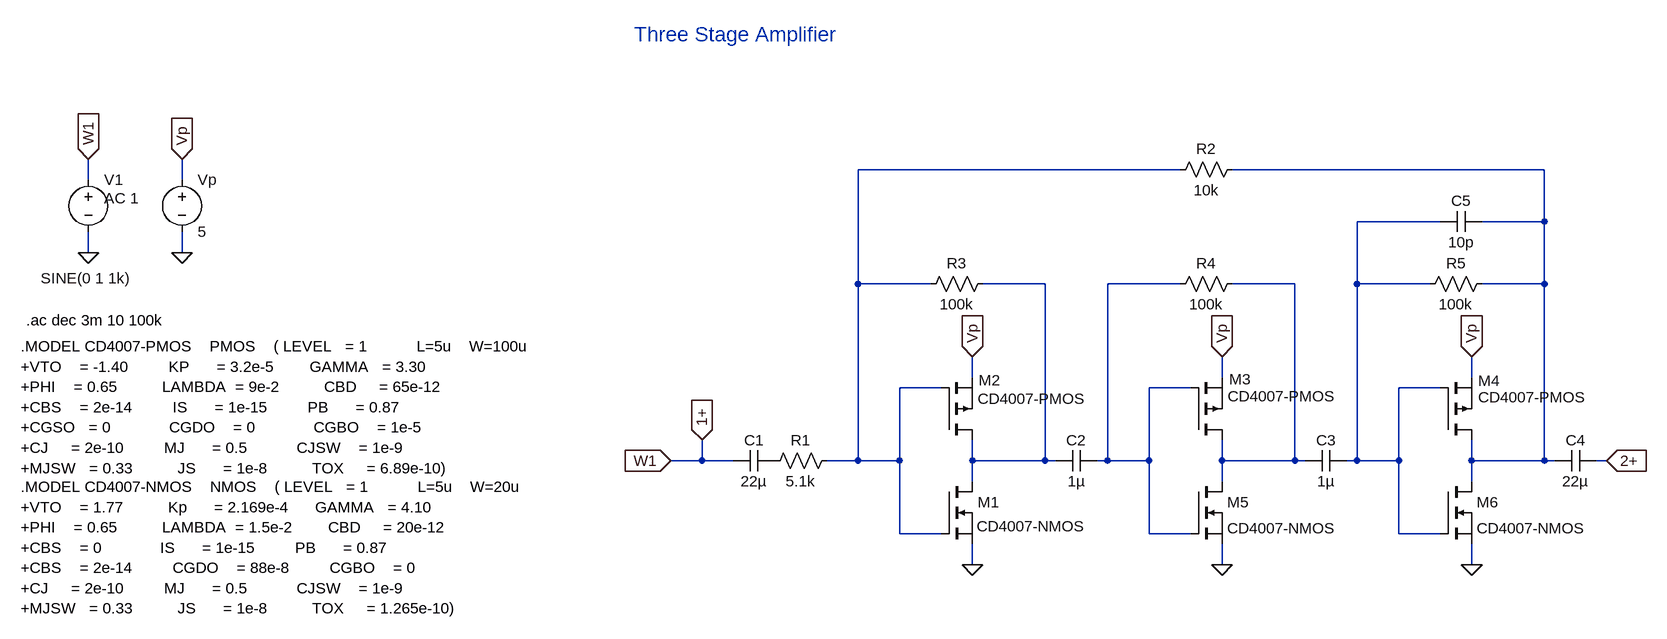
[diagram p0: schematic cmos_amplifier_hardware_setup_3a.asc]
cmos_amplifier_hardware_setup_3a.asc, the LTspice schematic file:
Version 4
SHEET 1 6340 1512
WIRE 912 800 416 800
WIRE 1472 800 992 800
WIRE -768 816 -768 784
WIRE -624 816 -624 784
WIRE 1312 880 1184 880
WIRE 1472 880 1472 800
WIRE 1472 880 1376 880
WIRE -768 928 -768 896
WIRE -624 928 -624 896
WIRE 416 976 416 800
WIRE 528 976 416 976
WIRE 704 976 608 976
WIRE 912 976 800 976
WIRE 1088 976 992 976
WIRE 1184 976 1184 880
WIRE 1296 976 1184 976
WIRE 1472 976 1472 880
WIRE 1472 976 1376 976
WIRE 592 1120 592 1088
WIRE 976 1120 976 1088
WIRE 1360 1120 1360 1088
WIRE 544 1136 480 1136
WIRE 928 1136 864 1136
WIRE 1312 1136 1248 1136
WIRE 176 1248 176 1216
WIRE 176 1248 128 1248
WIRE 224 1248 176 1248
WIRE 416 1248 416 976
WIRE 416 1248 368 1248
WIRE 480 1248 480 1136
WIRE 480 1248 416 1248
WIRE 592 1248 592 1216
WIRE 704 1248 704 976
WIRE 704 1248 592 1248
WIRE 720 1248 704 1248
WIRE 800 1248 800 976
WIRE 800 1248 784 1248
WIRE 864 1248 864 1136
WIRE 864 1248 800 1248
WIRE 976 1248 976 1216
WIRE 1088 1248 1088 976
WIRE 1088 1248 976 1248
WIRE 1104 1248 1088 1248
WIRE 1184 1248 1184 976
WIRE 1184 1248 1168 1248
WIRE 1248 1248 1248 1136
WIRE 1248 1248 1184 1248
WIRE 1360 1248 1360 1216
WIRE 1472 1248 1472 976
WIRE 1472 1248 1360 1248
WIRE 1488 1248 1472 1248
WIRE 1568 1248 1552 1248
WIRE 592 1280 592 1248
WIRE 976 1280 976 1248
WIRE 1360 1280 1360 1248
WIRE 480 1360 480 1248
WIRE 544 1360 480 1360
WIRE 864 1360 864 1248
WIRE 928 1360 864 1360
WIRE 1248 1360 1248 1248
WIRE 1312 1360 1248 1360
WIRE 592 1408 592 1376
WIRE 976 1408 976 1376
WIRE 1360 1408 1360 1376
FLAG 592 1408 0
FLAG 592 1088 Vp
IOPIN 592 1088 In
FLAG 128 1248 W1
IOPIN 128 1248 In
FLAG -768 928 0
FLAG -624 928 0
FLAG -624 784 Vp
IOPIN -624 784 In
FLAG -768 784 W1
IOPIN -768 784 In
FLAG 176 1216 1+
IOPIN 176 1216 In
FLAG 976 1408 0
FLAG 1360 1408 0
FLAG 976 1088 Vp
IOPIN 976 1088 In
FLAG 1360 1088 Vp
IOPIN 1360 1088 In
FLAG 1568 1248 2+
IOPIN 1568 1248 In
SYMBOL nmos 544 1280 R0
WINDOW 3 55 69 Left 2
SYMATTR Value CD4007-NMOS
SYMATTR InstName M1
SYMBOL pmos 544 1216 M180
WINDOW 3 56 63 Left 2
WINDOW 0 58 92 Left 2
SYMATTR Value CD4007-PMOS
SYMATTR InstName M2
SYMBOL voltage -624 800 R0
WINDOW 123 0 0 Left 0
WINDOW 39 0 0 Left 0
SYMATTR InstName Vp
SYMATTR Value 5
SYMBOL res 384 1232 R90
WINDOW 0 0 56 VBottom 2
WINDOW 3 32 56 VTop 2
SYMATTR InstName R1
SYMATTR Value 5.1k
SYMBOL res 624 960 R90
WINDOW 0 0 56 VBottom 2
WINDOW 3 32 56 VTop 2
SYMATTR InstName R3
SYMATTR Value 100k
SYMBOL cap 288 1232 R90
WINDOW 0 0 32 VBottom 2
WINDOW 3 32 32 VTop 2
SYMATTR InstName C1
SYMATTR Value 22µ
SYMBOL cap 784 1232 R90
WINDOW 0 0 32 VBottom 2
WINDOW 3 32 32 VTop 2
SYMATTR InstName C2
SYMATTR Value 1µ
SYMBOL pmos 928 1216 M180
WINDOW 0 59 93 Left 2
WINDOW 3 57 67 Left 2
SYMATTR InstName M3
SYMATTR Value CD4007-PMOS
SYMBOL pmos 1312 1216 M180
WINDOW 0 58 91 Left 2
WINDOW 3 58 66 Left 2
SYMATTR InstName M4
SYMATTR Value CD4007-PMOS
SYMBOL nmos 928 1280 R0
SYMATTR InstName M5
SYMATTR Value CD4007-NMOS
SYMBOL nmos 1312 1280 R0
SYMATTR InstName M6
SYMATTR Value CD4007-NMOS
SYMBOL res 1008 784 R90
WINDOW 0 0 56 VBottom 2
WINDOW 3 32 56 VTop 2
SYMATTR InstName R2
SYMATTR Value 10k
SYMBOL res 1008 960 R90
WINDOW 0 0 56 VBottom 2
WINDOW 3 32 56 VTop 2
SYMATTR InstName R4
SYMATTR Value 100k
SYMBOL res 1392 960 R90
WINDOW 0 0 56 VBottom 2
WINDOW 3 32 56 VTop 2
SYMATTR InstName R5
SYMATTR Value 100k
SYMBOL cap 1168 1232 R90
WINDOW 0 0 32 VBottom 2
WINDOW 3 32 32 VTop 2
SYMATTR InstName C3
SYMATTR Value 1µ
SYMBOL cap 1552 1232 R90
WINDOW 0 0 32 VBottom 2
WINDOW 3 32 32 VTop 2
SYMATTR InstName C4
SYMATTR Value 22µ
SYMBOL cap 1376 864 R90
WINDOW 0 0 32 VBottom 2
WINDOW 3 32 32 VTop 2
SYMATTR InstName C5
SYMATTR Value 10p
SYMBOL voltage -768 800 R0
WINDOW 3 -73 167 Left 2
WINDOW 123 24 44 Left 2
WINDOW 39 0 0 Left 0
SYMATTR Value SINE(0 1 1k)
SYMATTR Value2 AC 1
SYMATTR InstName V1
TEXT -872 1288 Left 2 !.MODEL CD4007-NMOS    NMOS    ( LEVEL   = 1           L=5u    W=20u             \n+VTO    = 1.77          Kp      = 2.169e-4      GAMMA   = 4.10  \n+PHI    = 0.65          LAMBDA  = 1.5e-2        CBD     = 20e-12\n+CBS    = 0             IS      = 1e-15         PB      = 0.87\n+CBS    = 2e-14         CGDO    = 88e-8         CGBO    = 0\n+CJ     = 2e-10         MJ      = 0.5           CJSW    = 1e-9\n+MJSW   = 0.33          JS      = 1e-8          TOX     = 1.265e-10)
TEXT -872 1072 Left 2 !.MODEL CD4007-PMOS    PMOS    ( LEVEL   = 1           L=5u    W=100u                \n+VTO    = -1.40         KP      = 3.2e-5        GAMMA   = 3.30  \n+PHI    = 0.65          LAMBDA  = 9e-2          CBD     = 65e-12\n+CBS    = 2e-14         IS      = 1e-15         PB      = 0.87\n+CGSO   = 0             CGDO    = 0             CGBO    = 1e-5\n+CJ     = 2e-10         MJ      = 0.5           CJSW    = 1e-9\n+MJSW   = 0.33          JS      = 1e-8          TOX     = 6.89e-10)
TEXT 72 592 Left 3 ;Three Stage Amplifier
TEXT -864 1032 Left 2 !.ac dec 3m 10 100k

The netlist it stands for:
* cmos_amplifier_hardware_setup_3a.asc
M1 N004 N001 0 0 CD4007-NMOS
M2 N004 N001 Vp Vp CD4007-PMOS
Vp Vp 0 5
R1 N001 P001 5.1k
R3 N004 N001 100k
C1 P001 1+ 22µ
C2 N005 N004 1µ
M3 N006 N005 Vp Vp CD4007-PMOS
M4 N002 N003 Vp Vp CD4007-PMOS
M5 N006 N005 0 0 CD4007-NMOS
M6 N002 N003 0 0 CD4007-NMOS
R2 N002 N001 10k
R4 N006 N005 100k
R5 N002 N003 100k
C3 N003 N006 1µ
C4 2+ N002 22µ
C5 N002 N003 10p
V1 1+ 0 SINE(0 1 1k) AC 1
.model NMOS NMOS
.model PMOS PMOS
.lib standard.mos
.MODEL CD4007-NMOS    NMOS    ( LEVEL   = 1           L=5u    W=20u
+VTO    = 1.77          Kp      = 2.169e-4      GAMMA   = 4.10
+PHI    = 0.65          LAMBDA  = 1.5e-2        CBD     = 20e-12
+CBS    = 0             IS      = 1e-15         PB      = 0.87
+CBS    = 2e-14         CGDO    = 88e-8         CGBO    = 0
+CJ     = 2e-10         MJ      = 0.5           CJSW    = 1e-9
+MJSW   = 0.33          JS      = 1e-8          TOX     = 1.265e-10)
.MODEL CD4007-PMOS    PMOS    ( LEVEL   = 1           L=5u    W=100u
+VTO    = -1.40         KP      = 3.2e-5        GAMMA   = 3.30
+PHI    = 0.65          LAMBDA  = 9e-2          CBD     = 65e-12
+CBS    = 2e-14         IS      = 1e-15         PB      = 0.87
+CGSO   = 0             CGDO    = 0             CGBO    = 1e-5
+CJ     = 2e-10         MJ      = 0.5           CJSW    = 1e-9
+MJSW   = 0.33          JS      = 1e-8          TOX     = 6.89e-10)
* Three Stage Amplifier
.ac dec 3m 10 100k
.backanno
.end